# Altium schematic sheet PY32F403C1xT_LINK.SchDoc: =DocumentName
size A3; Revision: V2.0; SheetNumber: 1; SheetTotal: 2
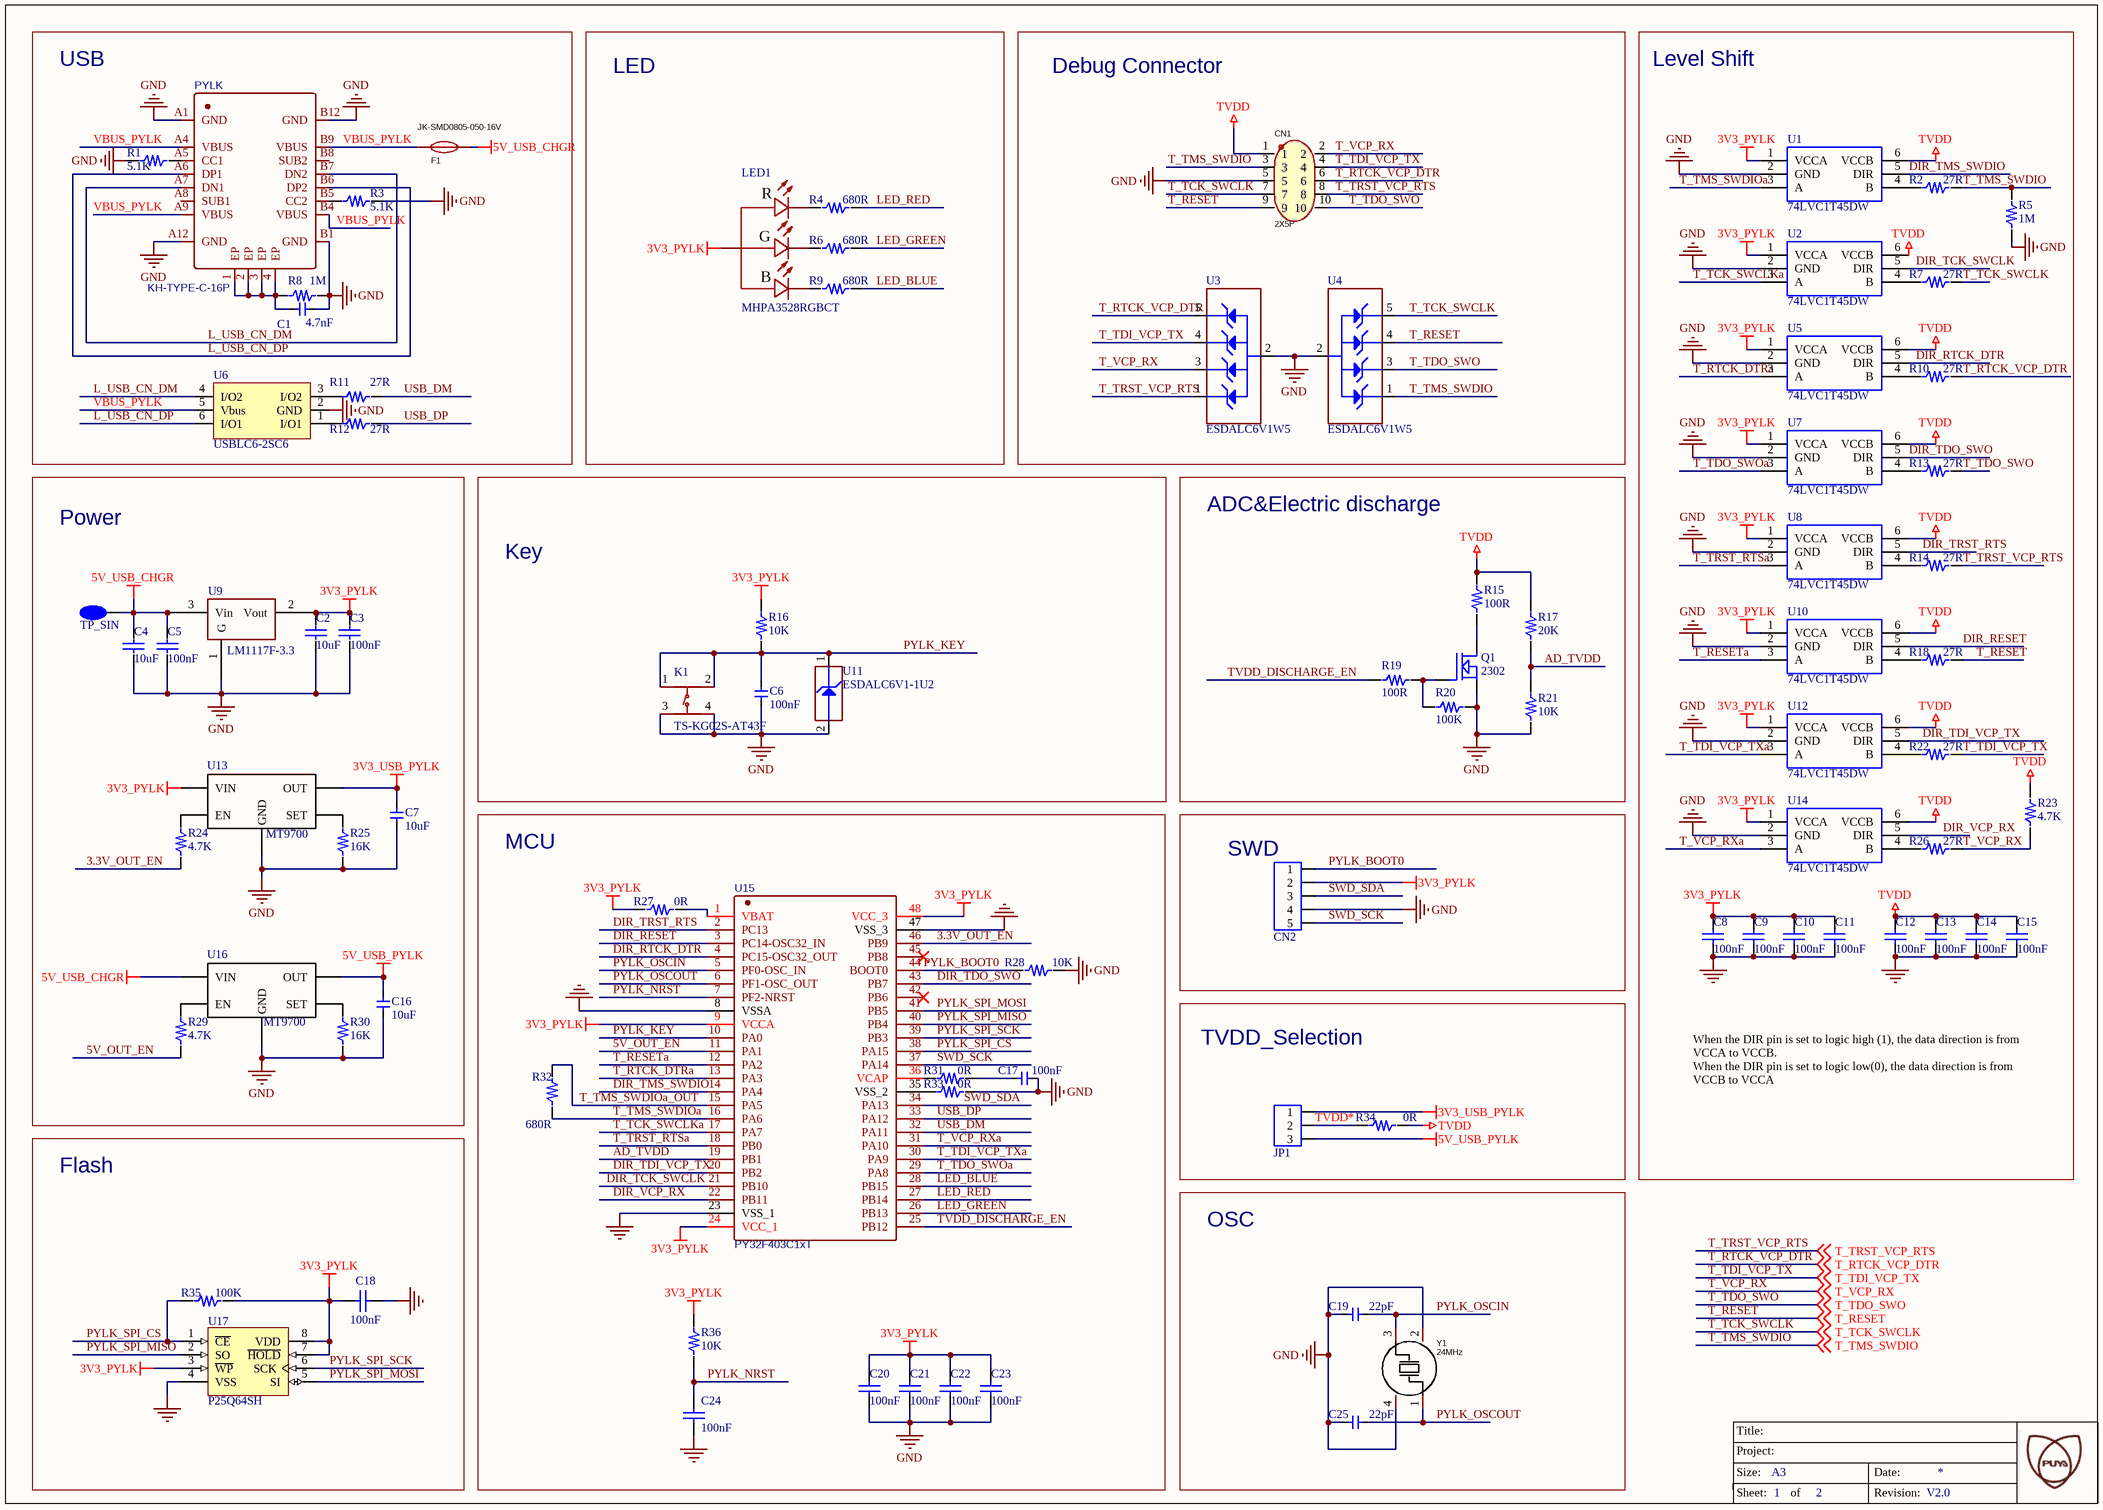
[diagram p0: PY32F403C1xT_LINK.SchDoc]

## Parts
1  TP_SIN  [TP_SIN]
C1  4.7nF  [C0603]
C2  10uF  [C0805]
C3  100nF  [C0603]
C4  10uF  [C0805]
C5  100nF  [C0603]
C6  100nF  [C0603]
C7  10uF  [C0805]
C8  100nF  [C0603]
C9  100nF  [C0603]
C10  100nF  [C0603]
C11  100nF  [C0603]
C12  100nF  [C0603]
C13  100nF  [C0603]
C14  100nF  [C0603]
C15  100nF  [C0603]
C16  10uF  [C0805]
C17  100nF  [C0603]
C18  100nF  [C0603]
C19  22pF  [C0603]
C20  100nF  [C0603]
C21  100nF  [C0603]
C22  100nF  [C0603]
C23  100nF  [C0603]
C24  100nF  [C0603]
C25  22pF  [C0603]
CN1  2X5P  [HDR2X5]
CN2  CON5  [CON5]  (value not drawn)
F1  JK-SMD0805-050-16V  [F0805]
JP1  CON3  [CON3]  (value not drawn)
K1  TS-KG02S-AT43F  [SW-SMD_4P-L6.0-W6.0-P4.50-LS8.5]
LED1  MHPA3528RGBCT  [LED-ARRAY-SMD_4P-L3.5-W2.8-TL]
PYLK  KH-TYPE-C-16P  [USB-C-SMD_KH-TYPE-C-16P]
Q1  2302  [SOT23]
R1  5.1K  [R0603]
R2  27R  [R0603]
R3  5.1K  [R0603]
R4  680R  [R0603]
R5  1M  [R0603]
R6  680R  [R0603]
R7  27R  [R0603]
R8  1M  [R0603]
R9  680R  [R0603]
R10  27R  [R0603]
R11  27R  [R0603]
R12  27R  [R0603]
R13  27R  [R0603]
R14  27R  [R0603]
R15  100R  [R0805]
R16  10K  [R0603]
R17  20K  [R0603]
R18  27R  [R0603]
R19  100R  [R0603]
R20  100K  [R0603]
R21  10K  [R0603]
R22  27R  [R0603]
R23  4.7K  [R0603]
R24  4.7K  [R0603]
R25  16K  [R0603]
R26  27R  [R0603]
R27  0R  [JP2_SMD]
R28  10K  [R0603]
R29  4.7K  [R0603]
R30  16K  [R0603]
R31  0R  [JP2_SMD]
R32  680R  [R0603]
R33  0R  [JP2_SMD]
R34  0R  [JP2_SMD]
R35  100K  [R0603]
R36  10K  [R0603]
U1  74LVC1T45DW  [SOT363]
U2  74LVC1T45DW  [SOT363]
U3  value ESDALC6V1W5  [ESD_SOT323-5L]  (hidden comment: ESD_6V1)
U4  value ESDALC6V1W5  [ESD_SOT323-5L]  (hidden comment: ESD_6V1)
U5  74LVC1T45DW  [SOT363]
U6  USBLC6-2SC6  [SOT23-6]
U7  74LVC1T45DW  [SOT363]
U8  74LVC1T45DW  [SOT363]
U9  LM1117F-3.3  [SOT-89-3_L4.5-W2.5-P1.50-LS4.2-BR]
U10  74LVC1T45DW  [SOT363]
U11  ESDALC6V1-1U2  [ESD_ST0201]
U12  74LVC1T45DW  [SOT363]
U13  MT9700  [SOT23-5]
U14  74LVC1T45DW  [SOT363]
U15  PY32F403C1xT  [LQFP-48_L7.0-W7.0-P0.50-LS9.0-BL]
U16  MT9700  [SOT23-5]
U17  P25Q64SH  [SOP-8P]
Y1  24MHz  [CRYSTAL-SMD_4P-L3.2-W2.5-BL]

## Blocks framed on the sheet
USB: C1 F1 PYLK R1 R3 R8 R11 R12 U6
LED: LED1 R4 R6 R9
Debug Connector: CN1 U3 U4
Level Shift: C8-C15 R2 R5 R7 R10 R13 R14 R18 R22 R23 R26 U1 U2 U5 U7 U8 U10 U12 U14
Power: 1 C2-C5 C7 C16 R24 R25 R29 R30 U9 U13 U16
Key: C6 K1 R16 U11
ADC&Electric discharge: Q1 R15 R17 R19-R21
MCU: C17 C20-C24 R27 R28 R31-R33 R36 U15
SWD: CN2
TVDD_Selection: JP1 R34
Flash: C18 R35 U17
OSC: C19 C25 Y1

## Nets
3V3_PYLK: C2.2 C3.2 C8.2 C9.2 C10.2 C11.2 C18.2 C20.2 C21.2 C22.2 C23.2 CN2.2 LED1.1(-) R16.2 R27.1 R35.2 R36.2 U1.1(VCCA) U2.1(VCCA) U5.1(VCCA) U7.1(VCCA) U8.1(VCCA) U9.2(Vout) U10.1(VCCA) U12.1(VCCA) U13.5(VIN) U14.1(VCCA) U15.9(VCCA) U15.24(VCC_1) U15.48(VCC_3) U17.3(~{WP}) U17.7(~{HOLD}) U17.8(VDD)
3V3_USB_PYLK: C7.2 JP1.1 U13.1(OUT)
5V_USB_CHGR: 1.1(TP_SIN) C4.2 C5.2 F1.2 U9.3(Vin) U16.5(VIN)
5V_USB_PYLK: C16.2 JP1.3 U16.1(OUT)
GND: C1.1 C2.1 C3.1 C4.1 C5.1 C6.1 C7.1 C8.1 C9.1 C10.1 C11.1 C12.1 C13.1 C14.1 C15.1 C16.1 C17.1 C18.1 C19.1 C20.1 C21.1 C22.1 C23.1 C24.1 C25.1 CN1.5 CN2.4 K1.3 K1.4 PYLK.A1(GND) PYLK.A12(GND) PYLK.B1(GND) PYLK.B12(GND) Q1.2(S) R1.1 R3.2 R5.1 R8.2 R20.1 R21.1 R25.1 R28.2 R30.1 R33.2 U1.2(GND) U2.2(GND) U3.2(GND) U4.2(GND) U5.2(GND) U6.2(GND) U7.2(GND) U8.2(GND) U9.1(G) U10.2(GND) U11.2(GND) U12.2(GND) U13.2(GND) U14.2(GND) U15.8(VSSA) U15.23(VSS_1) U15.47(VSS_3) U16.2(GND) U17.4(VSS) Y1.2(GND) Y1.4(GND)
TVDD: C12.2 C13.2 C14.2 C15.2 CN1.1 R15.2 R17.2 R23.2 R34.2 U1.6(VCCB) U2.6(VCCB) U5.6(VCCB) U7.6(VCCB) U8.6(VCCB) U10.6(VCCB) U12.6(VCCB) U14.6(VCCB)
3.3V_OUT_EN: R24.1 U15.46(PB9)
5V_OUT_EN: R29.1 U15.11(PA1)
AD_TVDD: R17.1 R21.2 U15.19(PB1)
DIR_RESET: U10.5(DIR) U15.3(PC14-OSC32_IN)
DIR_RTCK_DTR: U5.5(DIR) U15.4(PC15-OSC32_OUT)
DIR_TCK_SWCLK: U2.5(DIR) U15.21(PB10)
DIR_TDI_VCP_TX: U12.5(DIR) U15.20(PB2)
DIR_TDO_SWO: U7.5(DIR) U15.43(PB7)
DIR_TMS_SWDIO: U1.5(DIR) U15.14(PA4)
DIR_TRST_RTS: U8.5(DIR) U15.2(PC13)
DIR_VCP_RX: U14.5(DIR) U15.22(PB11)
L_USB_CN_DM: PYLK.A7(DN1) PYLK.B7(DN2) U6.4(I/O2)
L_USB_CN_DP: PYLK.A6(DP1) PYLK.B6(DP2) U6.6(I/O1)
LED_BLUE: R9.2 U15.28(PB15)
LED_GREEN: R6.2 U15.26(PB13)
LED_RED: R4.2 U15.27(PB14)
PYLK_BOOT0: CN2.1 R28.1 U15.44(BOOT0)
PYLK_KEY: C6.2 K1.1 K1.2 R16.1 U11.1(IO1) U15.10(PA0)
PYLK_NRST: C24.2 R36.1 U15.7(PF2-NRST)
PYLK_OSCIN: C19.2 U15.5(PF0-OSC_IN) Y1.3(OSC2)
PYLK_OSCOUT: C25.2 U15.6(PF1-OSC_OUT) Y1.1(OSC1)
PYLK_SPI_CS: R35.1 U15.38(PA15) U17.1(~{CE})
PYLK_SPI_MISO: U15.40(PB4) U17.2(SO)
PYLK_SPI_MOSI: U15.41(PB5) U17.5(SI)
PYLK_SPI_SCK: U15.39(PB3) U17.6(SCK)
SWD_SCK: CN2.5 U15.37(PA14)
SWD_SDA: CN2.3 U15.34(PA13)
T_RESET: CN1.9 R18.2 U4.4(IO3) ; off-sheet T_RESET
T_RESETa: U10.3(A) U15.12(PA2)
T_RTCK_DTRa: U5.3(A) U15.13(PA3)
T_RTCK_VCP_DTR: CN1.6 R10.2 U3.5(IO4) ; off-sheet T_RTCK_VCP_DTR
T_TCK_SWCLK: CN1.7 R7.2 U4.5(IO4) ; off-sheet T_TCK_SWCLK
T_TCK_SWCLKa: U2.3(A) U15.17(PA7)
T_TDI_VCP_TX: CN1.4 R22.2 U3.4(IO3) ; off-sheet T_TDI_VCP_TX
T_TDI_VCP_TXa: U12.3(A) U15.30(PA9)
T_TDO_SWO: CN1.10 R13.2 U4.3(IO2) ; off-sheet T_TDO_SWO
T_TDO_SWOa: U7.3(A) U15.29(PA8)
T_TMS_SWDIO: CN1.3 R2.2 R5.2 U4.1(IO1) ; off-sheet T_TMS_SWDIO
T_TMS_SWDIOa: R32.1 U1.3(A) U15.16(PA6)
T_TMS_SWDIOa_OUT: R32.2 U15.15(PA5)
T_TRST_RTSa: U8.3(A) U15.18(PB0)
T_TRST_VCP_RTS: CN1.8 R14.2 U3.1(IO1) ; off-sheet T_TRST_VCP_RTS
T_VCP_RX: CN1.2 R23.1 R26.2 U3.3(IO2) ; off-sheet T_VCP_RX
T_VCP_RXa: U14.3(A) U15.31(PA10)
TVDD*: JP1.2 R34.1
TVDD_DISCHARGE_EN: R19.2 U15.25(PB12)
USB_DM: R11.2 U15.32(PA11)
USB_DP: R12.2 U15.33(PA12)
VBUS_PYLK: F1.1 PYLK.A4(VBUS) PYLK.A9(VBUS) PYLK.B4(VBUS) PYLK.B9(VBUS) U6.5(Vbus)
NetC1_2: C1.2 PYLK.1(EP) PYLK.2(EP) PYLK.3(EP) PYLK.4(EP) R8.1
NetC17_2: C17.2 R31.2
NetLED1_2: LED1.2(-) R9.1
NetLED1_3: LED1.3(-) R6.1
NetLED1_4: LED1.4(-) R4.1
NetPYLK_A5: PYLK.A5(CC1) R1.2
NetPYLK_B5: PYLK.B5(CC2) R3.1
NetQ1_1: Q1.1(G) R19.1 R20.2
NetQ1_3: Q1.3(D) R15.1
NetR2_1: R2.1 U1.4(B)
NetR7_1: R7.1 U2.4(B)
NetR10_1: R10.1 U5.4(B)
NetR11_1: R11.1 U6.3(I/O2)
NetR12_1: R12.1 U6.1(I/O1)
NetR13_1: R13.1 U7.4(B)
NetR14_1: R14.1 U8.4(B)
NetR18_1: R18.1 U10.4(B)
NetR22_1: R22.1 U12.4(B)
NetR24_2: R24.2 U13.4(EN)
NetR25_2: R25.2 U13.3(SET)
NetR26_1: R26.1 U14.4(B)
NetR27_2: R27.2 U15.1(VBAT)
NetR29_2: R29.2 U16.4(EN)
NetR30_2: R30.2 U16.3(SET)
NetR31_1: R31.1 U15.36(VCAP)
NetR33_1: R33.1 U15.35(VSS_2)

Not connected (* = marked no-connect by the designer): PYLK A8(SUB1) B8(SUB2); U15 42(PB6)* 45(PB8)*

## Notes on the sheet
- When the DIR pin is set to logic high (1), the data direction is from VCCA to VCCB.
  When the DIR pin is set to logic low(0), the data direction is from VCCB to VCCA
- Title:
- Project:
- Size:
- Sheet:
- A3
- of
- Date:
- Revision:
- (in symbol MHPA3528RGBCT) R; G; B

## Library data of the parts
C1 C3 C5 C6 C17 C19 C25 = C0603: PCB DECAL: 0603
C2 C4 C7 C16 = C0805: PCB DECAL: 0805
C8-C15 C18 C20-C24 = 贴片高压陶瓷电容: Capacitor (Semiconductor SIM Model); 器件封装(外观): 0603; Value: 104
CN1 = 2X5P: Manufacturer: XFCN(兴飞); Symbol: PZ254V-12-10P; Add into BOM: yes; Pitch: 2.54mm; Circluar Pins/Square Pins: 方针; Device: PZ254V-12-10P; LCSC Part Name: 间距:2.54mm 2x5P 直插 方针; Supplier Part: C492422; Manufacturer Part: PZ254V-12-10P; Supplier Footprint: 插件,P=2.54mm; JLCPCB Part Class: Extended Part; Datasheet: https://atta.szlcsc.com/upload/public/pdf/source/20200309/C492422_5020CEA01BE7051F9EA9DD81AB0A25E3.pdf; Supplier: LCSC; Convert to PCB: yes; Pin Structure: 2x5P; Row Spacing: 2.54mm; Mounting Type: 直插; Number of Rows: 双排; Number of Pins: 10P; Current Rating (Max): -; Voltage Rating (Max): -; Length of Mating Pin: 6mm; Insulation Height: 2.5mm; Length of End Connection Pin: 3mm; Contact Material: 黄铜; Contact Plating: -; Operating Temperature Range: -40℃~+105℃; Color: 黑色
F1 = JK-SMD0805-050-16V: Manufacturer: JK(金科); Add into BOM: yes; Voltage - Max: 6V; Current - Max: 100A; Hold Current: 500mA; Trip Current: 1A; Power Dissipation: 600mW; Resistance - Initial (Ri) (Min): 150mΩ; Resistance - Post Trip (R1) (Max): 850mΩ; Time to Trip(Max): 100ms; Symbol: JK-SMD0805-050-16V; Device: JK-SMD0805-050-16V; LCSC Part Name: 6V 0.5A 贴片自恢复; Supplier Part: C968441; Manufacturer Part: JK-SMD0805-050-16V; Supplier Footprint: SMD; JLCPCB Part Class: Extended Part; Datasheet: https://atta.szlcsc.com/upload/public/pdf/source/20190306/C369151_789C15D625FD73830E24950182550D65.pdf; Supplier: LCSC; Convert to PCB: yes; Operating Temperature: -40℃~+85℃
K1 = TS-KG02S-AT43F: Manufacturer: HANBO(汉博); Add into BOM: yes; Circuit: 单刀单掷; Actuator Style: 圆形按钮; Operating Force: 250gf; Switch Length: 6mm; Switch Height: 4.3mm; Strike Gundam: 不带; Contact Current: 50mA; Voltage Rating (DC): 12V; Insulation Resistance: 100MΩ; Actuator/Cap Color: 黑色; Pin Style: 鸥翼型; Symbol: TS-KG02S-AT43F; Device: TS-KG02S-AT43F; LCSC Part Name: 6*6*4.3mm 立贴 轻触开关; Supplier Part: C2874283; Manufacturer Part: TS-KG02S-AT43F; Supplier Footprint: SMD; JLCPCB Part Class: 扩展库; Datasheet: https://atta.szlcsc.com/upload/public/pdf/source/20221110/4B16732C66B2A039D9853E84B21A4EEA.pdf; Supplier: LCSC; Convert to PCB: yes; Mounting Style: 立贴; Switch Width: 6mm; Mechanical Life: -
LED1 = MHPA3528RGBCT: Manufacturer: MEIHUA(美华); Add into BOM: yes; Symbol: MHPA3528RGBCT; Device: MHPA3528RGBCT; LCSC Part Name: RGB三色; Supplier Part: C409779; Manufacturer Part: MHPA3528RGBCT; Supplier Footprint: SMD3528; JLCPCB Part Class: 扩展库; Datasheet: https://atta.szlcsc.com/upload/public/pdf/source/20190902/C409779_9EA0C46D876E94D2A4E683BAC3DDD702.pdf; Supplier: LCSC; Convert to PCB: yes
PYLK = KH-TYPE-C-16P: BOM_Manufacturer: Shenzhen Kinghelm Elec; Contributor: LCSC; BOM_Supplier: LCSC; BOM_Supplier Part: C709357; BOM_Manufacturer Part: KH-TYPE-C-16P; BOM_JLCPCB Part Class: Extended Part; spicePre: U; spiceSymbolName: KH-TYPE-C-16P
Q1 = MOSFET N: Value: SI2302; 器件封装(外观): SOT23
R1-R14 R16-R24 R26-R29 R31-R36 = R0603: PCB DECAL: 0603
R15 = R0805: PCB DECAL: 0805
R25 R30 = R0603_7: 0603WAF1602T5E 16KΩ(1602) ±1%; PCB DECAL: 0603
U3 U4 = ESDALC6V1W5: Dual Transil array for ESD protection; Internal_Part_Number: MCD-00136; Part_Type: Diode; Manufacturer: STMICROELECTRONICS; ECCN_US: EAR99; ECCN_EU: NEC; Provided_By: Subcon; Initial_Board_Reference: MB1262; Status: Released; Manufacturer_Part_Number: ESDALC6V1W5; ComponentLink1Description: STM_ESD_ESDALC6V1W5.pdf; ComponentLink1URL: http://tunmcdsvn.tun.st.com/Component_Datasheet_Library/Trunk/Diodes/STM_ESD_ESDALC6V1W5
U6 = USBLC6-2SC6: Function: ESD EMI fliter
U11 = ESDALC6V1-1U2: ESD protection 6V1; Internal_Part_Number: MCD-00170; Part_Type: Diode; Manufacturer: STMICROELECTRONICS; ECCN_US: EAR99; ECCN_EU: NEC; Provided_By: Subcon; Initial_Board_Reference: MB1274; Status: Released; Manufacturer_Part_Number: ESDALC6V1-1U2; ComponentLink1Description: STM_ESD_ESDALC6V1-1U2.pdf; ComponentLink1URL: http://tunmcdsvn.tun.st.com/Component_Datasheet_Library/Trunk/Diodes/STM_ESD_ESDALC6V1-1U2; Value: ESDALC6V1-1U2
U15 = PY32F403C1xT: LQFP48; BOM_Manufacturer: PUYA(普冉); BOM_Manufacturer Part: PY32F403C1xT; spicePre: U; spiceSymbolName: PY32F403C1xT
U17 = SST25VF010: Value: SST25VF020B; 器件封装(外观): SOP8
Y1 = ABM8AIG-24.000MHZ-82Z-T: ±20ppm , 12.5pF , T_use: -40°C~125°C; Manufacturer: ABRACON; Add into BOM: yes; External load capacitor: 8pF; Frequency Stability(Full temperature range): ±50ppm; Equivalent Series Resistance (ESR): 50Ω; Name: 24MHz; Symbol: ABM8AIG-24.000MHZ-82Z-T; Device: ABM8AIG-24.000MHZ-82Z-T; LCSC Part Name: 24MHz ±20ppm 8pF; Supplier Part: C1669761; Manufacturer Part: ABM8AIG-24.000MHZ-82Z-T; Supplier Footprint: SMD3225-4P; JLCPCB Part Class: Extended Part; Datasheet: https://atta.szlcsc.com/upload/public/pdf/source/20210326/C1986479_1F0B0D93791ADB7A90489BA856D17A98.pdf; Supplier: LCSC; Convert to PCB: yes; Value: 24MHz; Normal temperature Frequency Tolerance: ±20ppm; Operating Temperature: -40℃~+125℃